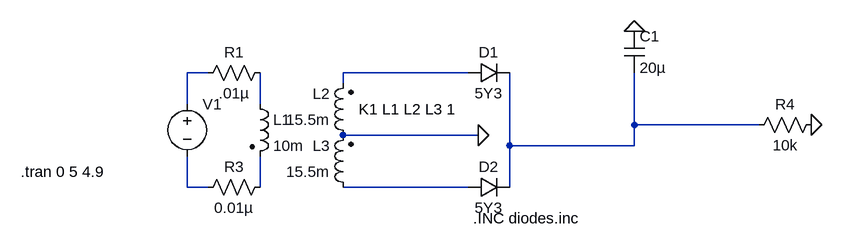
[diagram p0: schematic Moonlight.asc]
Moonlight.asc, the LTspice schematic file:
Version 4
SHEET 1 932 680
WIRE -16 80 -48 80
WIRE 384 80 192 80
WIRE 192 96 192 80
WIRE -48 128 -48 80
WIRE 64 128 64 80
WIRE 640 160 640 80
WIRE 832 160 640 160
WIRE 400 176 192 176
WIRE 448 192 448 80
WIRE 640 192 640 160
WIRE 640 192 448 192
WIRE -48 256 -48 208
WIRE -16 256 -48 256
WIRE 64 256 64 208
WIRE 384 256 192 256
WIRE 448 256 448 192
FLAG 400 176 0
FLAG 640 16 0
FLAG 912 160 0
SYMBOL voltage -48 112 R0
WINDOW 3 24 104 Invisible 0
WINDOW 123 0 0 Left 0
WINDOW 39 0 0 Left 0
SYMATTR Value SINE(0 326 60)
SYMATTR InstName V1
SYMBOL ind2 48 112 R0
SYMATTR InstName L1
SYMATTR Value 10m
SYMATTR Type ind
SYMBOL ind2 208 192 R180
WINDOW 0 36 80 Left 0
WINDOW 3 36 40 Left 0
SYMATTR InstName L2
SYMATTR Value 15.5m
SYMATTR Type ind
SYMBOL ind2 208 272 R180
WINDOW 0 36 80 Left 0
WINDOW 3 36 40 Left 0
SYMATTR InstName L3
SYMATTR Value 15.5m
SYMATTR Type ind
SYMBOL cap 624 16 R0
SYMATTR InstName C1
SYMATTR Value 20µ
SYMBOL res 928 144 R90
WINDOW 0 0 56 VBottom 0
WINDOW 3 32 56 VTop 0
SYMATTR InstName R4
SYMATTR Value 10k
SYMBOL res 80 64 R90
WINDOW 0 0 56 VBottom 0
WINDOW 3 32 56 VTop 0
SYMATTR InstName R1
SYMATTR Value .01µ
SYMBOL res 80 240 R90
WINDOW 0 0 56 VBottom 0
WINDOW 3 32 56 VTop 0
SYMATTR InstName R3
SYMATTR Value 0.01µ
SYMBOL diode 384 96 R270
WINDOW 0 32 32 VTop 0
WINDOW 3 0 32 VBottom 0
SYMATTR InstName D1
SYMATTR Value 5Y3
SYMBOL diode 384 272 R270
WINDOW 0 32 32 VTop 0
WINDOW 3 0 32 VBottom 0
SYMATTR InstName D2
SYMATTR Value 5Y3
TEXT -304 232 Left 0 !.tran 0 5 4.9
TEXT 216 136 Left 0 !K1 L1 L2 L3 1
TEXT 392 304 Left 0 !.INC diodes.inc

The netlist it stands for:
* Moonlight.asc
V1 N001 N005 SINE(0 326 60)
L1 N003 N006 10m
L2 0 N002 15.5m
L3 N007 0 15.5m
C1 0 N004 20µ
R4 0 N004 10k
R1 N003 N001 .01µ
R3 N006 N005 0.01µ
D1 N002 N004 5Y3
D2 N007 N004 5Y3
.model D D
.lib standard.dio
.tran 0 5 4.9
K1 L1 L2 L3 1
.INC diodes.inc
.backanno
.end